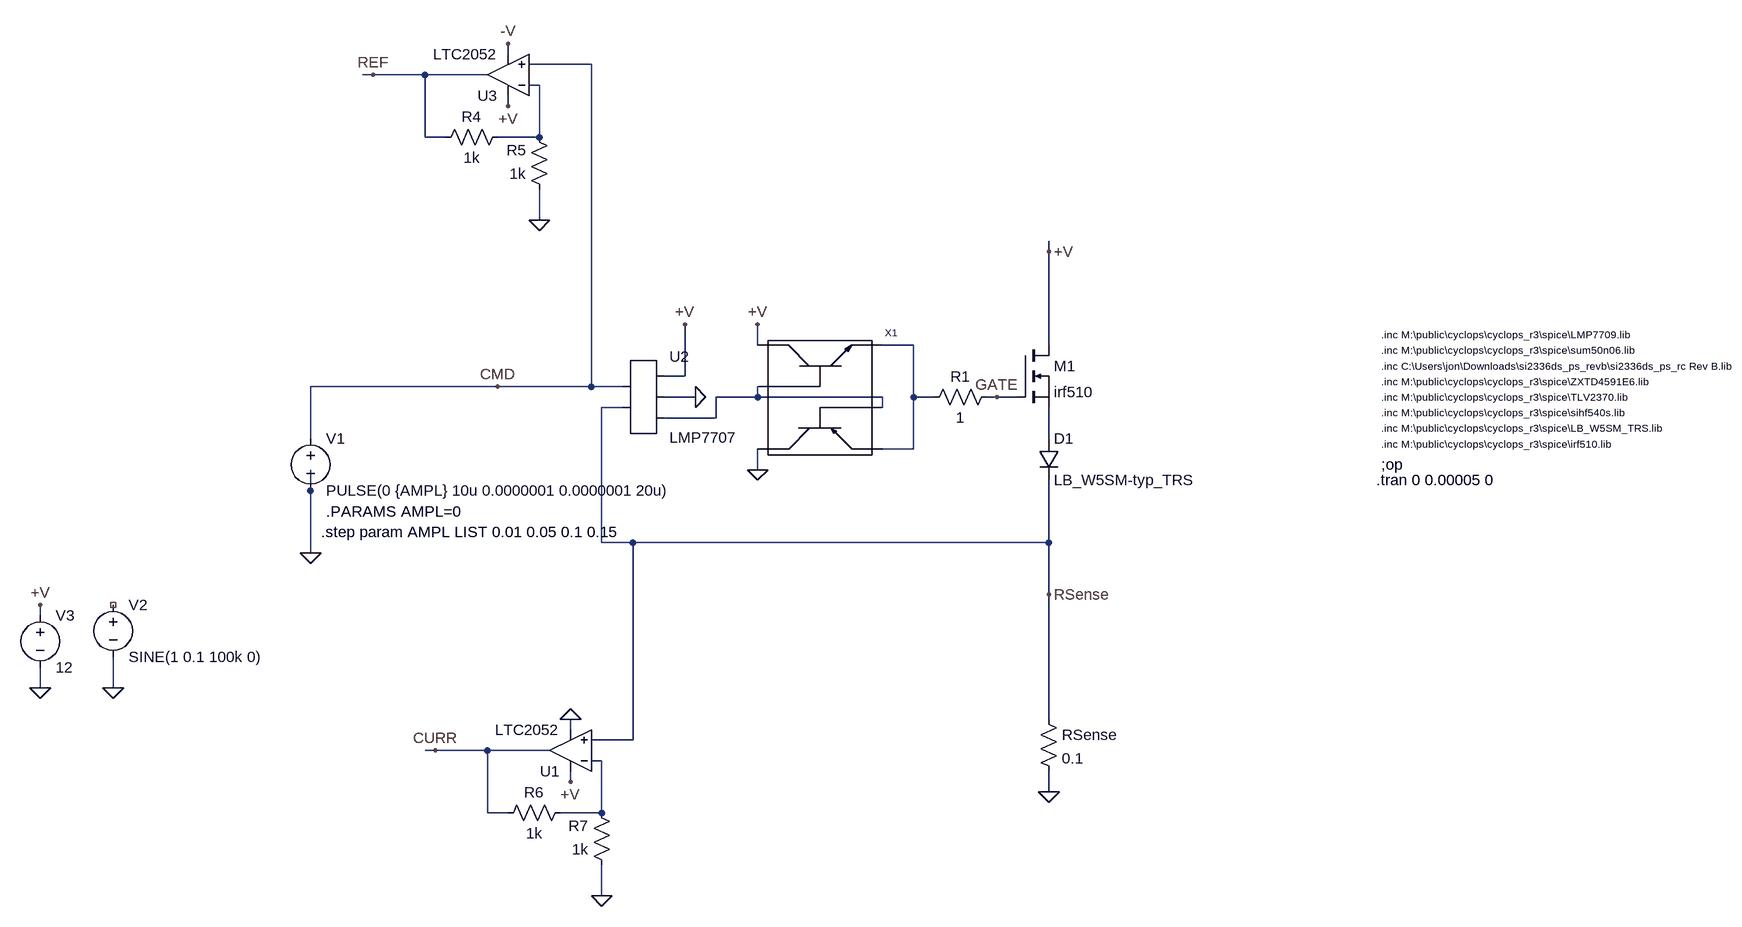
[diagram p0: schematic cyclops_r3.4_rsense_0R1.asc]
cyclops_r3.4_rsense_0R1.asc, the LTspice schematic file:
Version 4
SHEET 1 1460 980
WIRE -672 -352 -672 -368
WIRE -544 -336 -640 -336
WIRE -880 -320 -896 -320
WIRE -800 -320 -880 -320
WIRE -704 -320 -800 -320
WIRE -624 -304 -640 -304
WIRE -672 -272 -672 -288
WIRE -800 -224 -800 -320
WIRE -768 -224 -800 -224
WIRE -624 -224 -624 -304
WIRE -624 -224 -688 -224
WIRE -624 -96 -624 -144
WIRE 160 -48 160 -64
WIRE -288 96 -288 64
WIRE -48 96 -96 96
WIRE 160 96 160 -48
WIRE -400 144 -400 64
WIRE -400 144 -432 144
WIRE -688 160 -976 160
WIRE -544 160 -544 -336
WIRE -544 160 -688 160
WIRE -496 160 -544 160
WIRE -384 176 -432 176
WIRE -288 176 -288 160
WIRE -288 176 -352 176
WIRE -96 176 -288 176
WIRE -48 176 -48 96
WIRE -16 176 -48 176
WIRE 80 176 64 176
WIRE 112 176 80 176
WIRE -496 192 -528 192
WIRE -96 192 -96 176
WIRE -352 208 -352 176
WIRE -352 208 -432 208
WIRE -976 240 -976 160
WIRE 160 240 160 192
WIRE -48 256 -48 176
WIRE -48 256 -96 256
WIRE -288 288 -288 256
WIRE -976 320 -976 288
WIRE -528 400 -528 192
WIRE -480 400 -528 400
WIRE 160 400 160 304
WIRE 160 400 -480 400
WIRE -976 416 -976 320
WIRE 160 480 160 400
WIRE -1392 512 -1392 496
WIRE -1392 624 -1392 592
WIRE -1280 624 -1280 576
WIRE 160 672 160 480
WIRE -576 688 -576 672
WIRE -480 704 -480 400
WIRE -480 704 -544 704
WIRE -784 720 -800 720
WIRE -704 720 -784 720
WIRE -608 720 -704 720
WIRE -528 736 -544 736
WIRE -576 768 -576 752
WIRE 160 784 160 752
WIRE -704 816 -704 720
WIRE -672 816 -704 816
WIRE -528 816 -528 736
WIRE -528 816 -592 816
WIRE -528 944 -528 896
FLAG 160 784 0
FLAG -976 416 0
FLAG 160 480 RSense
FLAG -1392 624 0
FLAG -1392 496 +V
FLAG 160 -48 +V
FLAG -288 64 +V
FLAG -288 288 0
FLAG -400 64 +V
FLAG 80 176 GATE
FLAG -688 160 CMD
FLAG -1280 624 0
FLAG -880 -320 REF
FLAG -624 -96 0
FLAG -672 -368 -V
FLAG -672 -272 +V
FLAG -784 720 CURR
FLAG -528 944 0
FLAG -576 672 0
FLAG -576 768 +V
FLAG -384 176 0
SYMBOL nmos 112 96 R0
SYMATTR InstName M1
SYMATTR Value irf510
SYMATTR Prefix X
SYMBOL res 144 656 R0
SYMATTR InstName RSense
SYMATTR Value 0.1
SYMATTR SpiceLine pwr=20
SYMBOL voltage -976 224 R0
WINDOW 123 0 0 Left 2
WINDOW 39 0 0 Left 2
SYMATTR InstName V1
SYMATTR Value PULSE(0 {AMPL} 10u 0.0000001 0.0000001 20u)
SYMBOL voltage -1392 496 R0
WINDOW 123 0 0 Left 2
WINDOW 39 0 0 Left 2
SYMATTR InstName V3
SYMATTR Value 12
SYMBOL diode 144 240 R0
SYMATTR InstName D1
SYMATTR Value LB_W5SM-typ_TRS
SYMBOL ZXTD45 -192 176 R0
SYMATTR InstName X1
SYMATTR Prefix X
SYMATTR Value ZXTD4591E6
SYMBOL res 80 160 R90
WINDOW 0 0 56 VBottom 2
WINDOW 3 32 56 VTop 2
SYMATTR InstName R1
SYMATTR Value 1
SYMBOL voltage -1280 480 R0
WINDOW 123 0 0 Left 2
WINDOW 39 0 0 Left 2
SYMATTR InstName V2
SYMATTR Value SINE(1 0.1 100k 0)
SYMBOL Opamps\\LTC2052 -672 -320 R180
SYMATTR InstName U3
SYMBOL res -672 -240 R90
WINDOW 0 0 56 VBottom 2
WINDOW 3 32 56 VTop 2
SYMATTR InstName R4
SYMATTR Value 1k
SYMBOL res -608 -128 R180
WINDOW 0 36 76 Left 2
WINDOW 3 36 40 Left 2
SYMATTR InstName R5
SYMATTR Value 1k
SYMBOL Opamps\\LTC2052 -576 720 R180
SYMATTR InstName U1
SYMBOL res -576 800 R90
WINDOW 0 0 56 VBottom 2
WINDOW 3 32 56 VTop 2
SYMATTR InstName R6
SYMATTR Value 1k
SYMBOL res -512 912 R180
WINDOW 0 36 76 Left 2
WINDOW 3 36 40 Left 2
SYMATTR InstName R7
SYMATTR Value 1k
SYMBOL AutoGenerated\\LMP7707 -464 176 R0
SYMATTR InstName U2
TEXT 672 200 Left 1 !.inc M:\\public\\cyclops\\cyclops_r3\\spice\\sihf540s.lib
TEXT 672 280 Left 2 !;op
TEXT 672 224 Left 1 !.inc M:\\public\\cyclops\\cyclops_r3\\spice\\LB_W5SM_TRS.lib
TEXT 664 304 Left 2 !.tran 0 0.00005 0
TEXT 672 176 Left 1 !.inc M:\\public\\cyclops\\cyclops_r3\\spice\\TLV2370.lib
TEXT 672 152 Left 1 !.inc M:\\public\\cyclops\\cyclops_r3\\spice\\ZXTD4591E6.lib
TEXT 672 248 Left 1 !.inc M:\\public\\cyclops\\cyclops_r3\\spice\\irf510.lib
TEXT 672 128 Left 1 !.inc C:\\Users\\jon\\Downloads\\si2336ds_ps_revb\\si2336ds_ps_rc Rev B.lib
TEXT 672 104 Left 1 !.inc M:\\public\\cyclops\\cyclops_r3\\spice\\sum50n06.lib
TEXT 672 80 Left 1 !.inc M:\\public\\cyclops\\cyclops_r3\\spice\\LMP7709.lib
TEXT -952 352 Left 2 !.PARAMS AMPL=0
TEXT -960 384 Left 2 !.step param AMPL LIST 0.01 0.05 0.1 0.15

The netlist it stands for:
* cyclops_r3.4_rsense_0R1.asc
XM1 +V GATE N004 irf510  ; pins D G S
RSense RSense 0 0.1 pwr=20
V1 CMD 0 PULSE(0 {AMPL} 10u 0.0000001 0.0000001 20u)
V3 +V 0 12
D1 N004 RSense LB_W5SM-typ_TRS
XX1 +V N003 0 N002 N003 N002 ZXTD45 params: ZXTD4591E6  ; pins C1 B1 C2 E2 B2 E1
R1 GATE N002 1
V2 NC_01 0 SINE(1 0.1 100k 0)
* U3: LTC2052 (symbol Opamps\LTC2052 not available, pins judged from their places): In+=CMD In-=N001 V+=+V V-=-V OUT=REF
R4 N001 REF 1k
R5 0 N001 1k
* U1: LTC2052 (symbol Opamps\LTC2052 not available, pins judged from their places): In+=RSense In-=N005 V+=+V V-=0 OUT=CURR
R6 N005 CURR 1k
R7 0 N005 1k
* U2: LMP7707 (symbol AutoGenerated\LMP7707 not available, pins judged from their places): pin1=CMD pin2=RSense pin3=+V pin4=0 pin5=N003
.model D D
.lib standard.dio
.inc M:\public\cyclops\cyclops_r3\spice\sihf540s.lib
;op
.inc M:\public\cyclops\cyclops_r3\spice\LB_W5SM_TRS.lib
.tran 0 0.00005 0
.inc M:\public\cyclops\cyclops_r3\spice\TLV2370.lib
.inc M:\public\cyclops\cyclops_r3\spice\ZXTD4591E6.lib
.inc M:\public\cyclops\cyclops_r3\spice\irf510.lib
.inc C:\Users\jon\Downloads\si2336ds_ps_revb\si2336ds_ps_rc Rev B.lib
.inc M:\public\cyclops\cyclops_r3\spice\sum50n06.lib
.inc M:\public\cyclops\cyclops_r3\spice\LMP7709.lib
.PARAMS AMPL=0
.step param AMPL LIST 0.01 0.05 0.1 0.15
.backanno
.end